# EAGLE schematic CircuitClockSchematic (EAGLE 9.3.0)
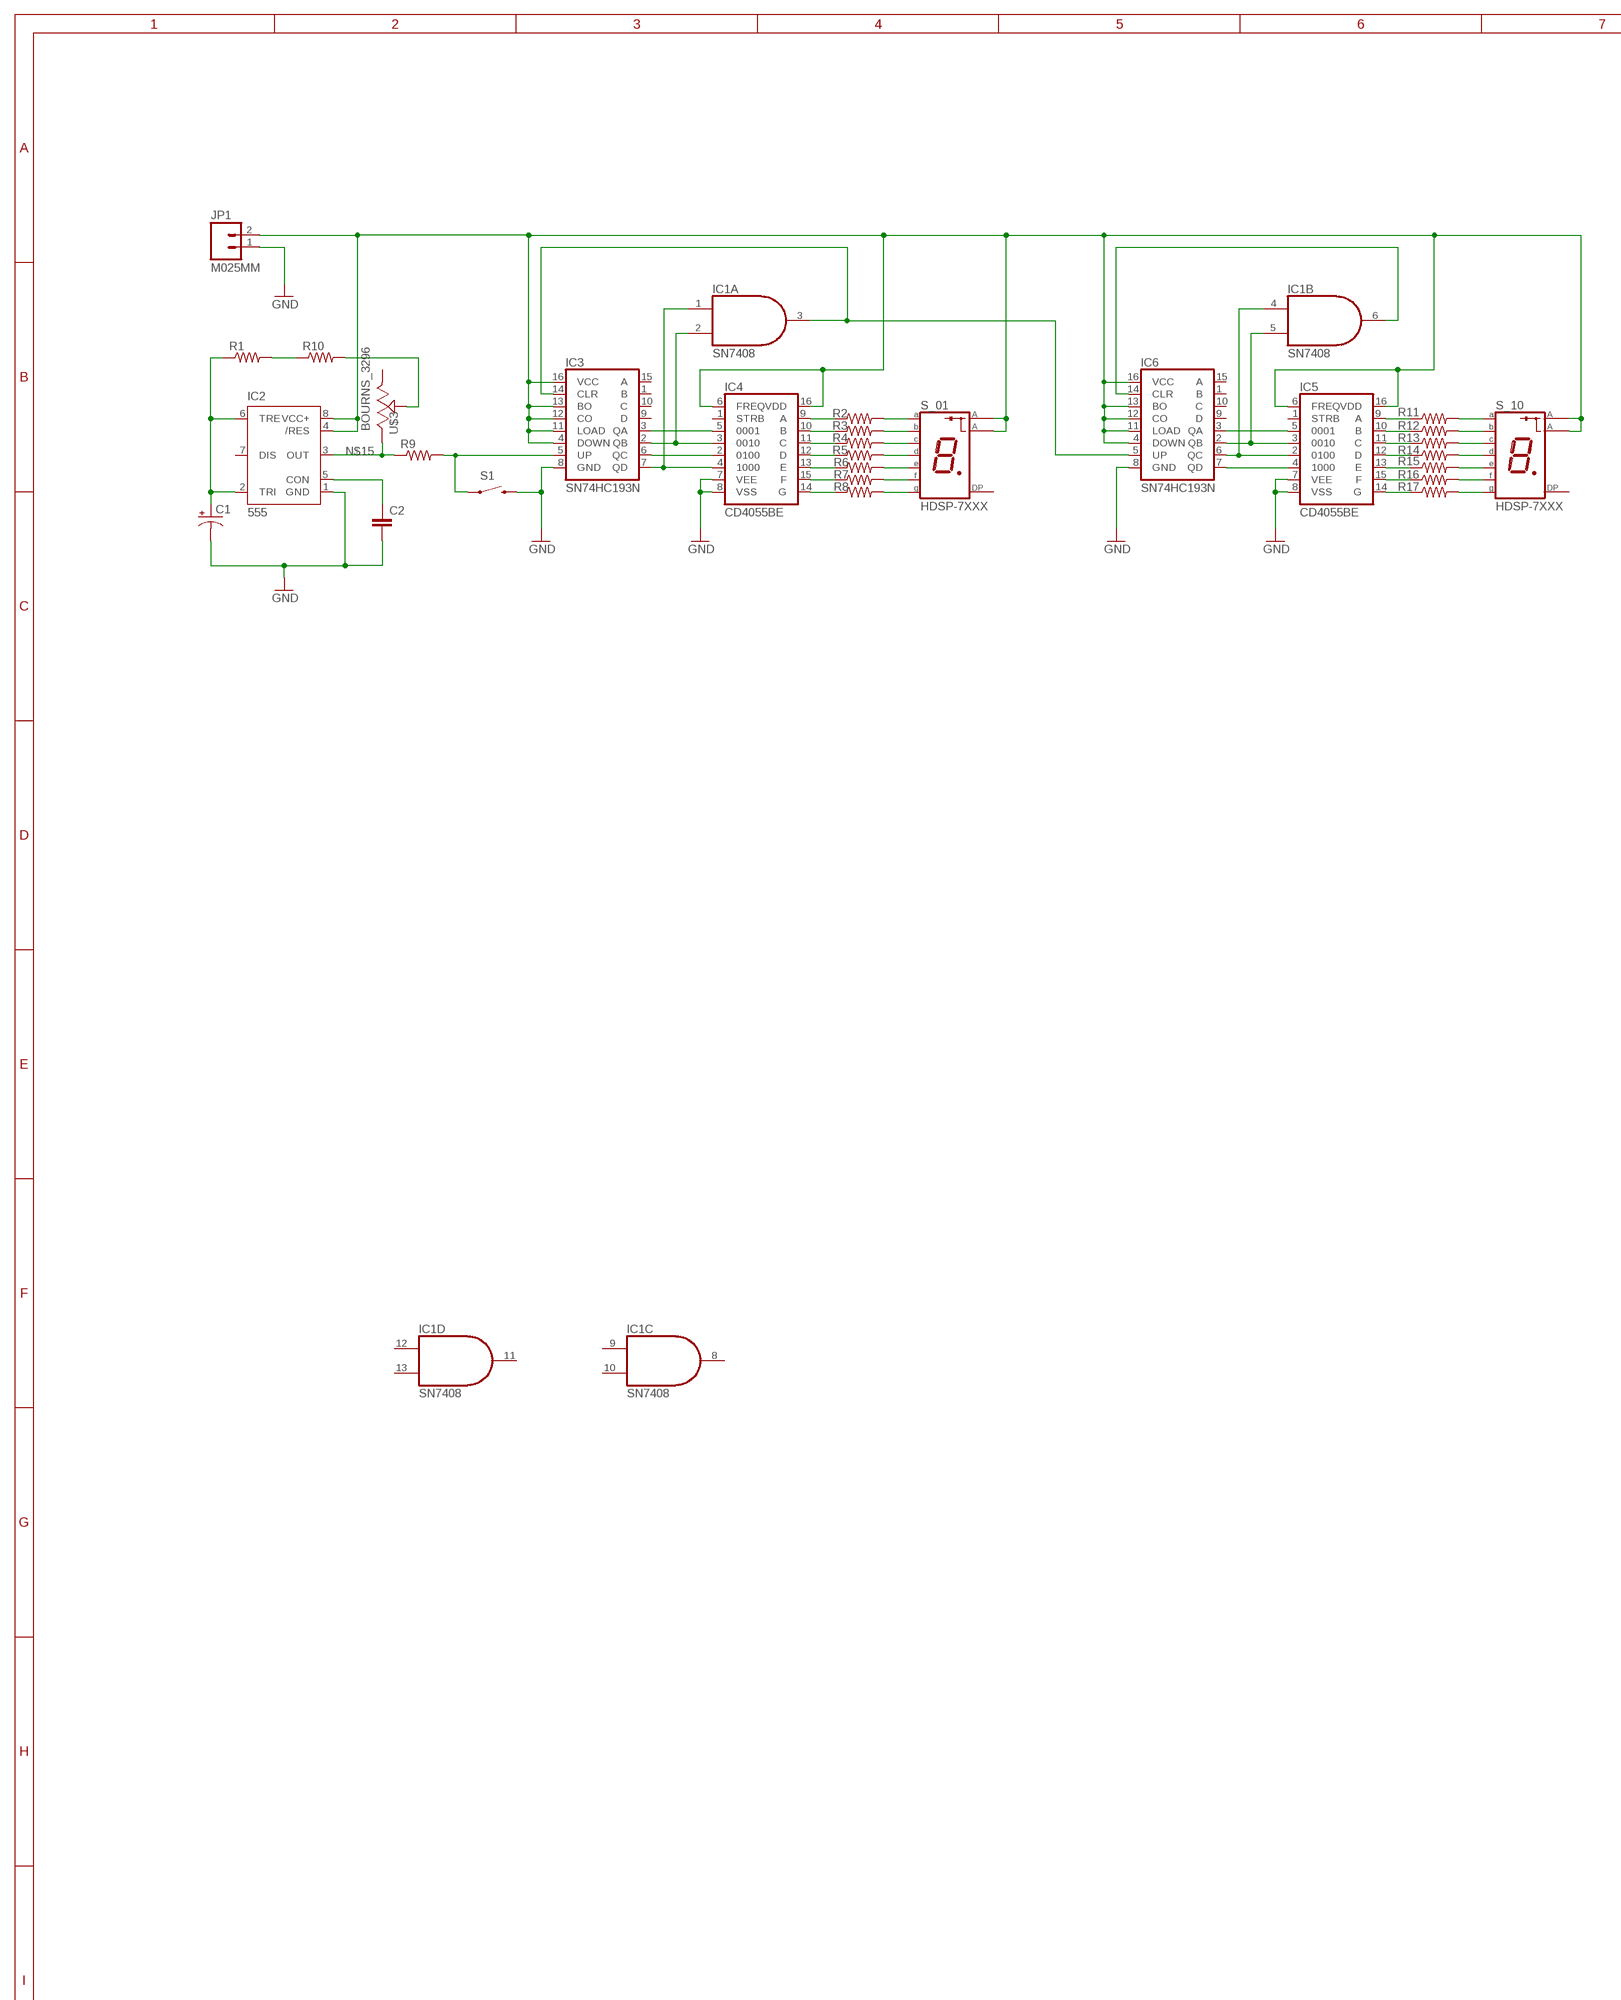
[diagram p0: schematic, sheet 1, part 1 of 2]
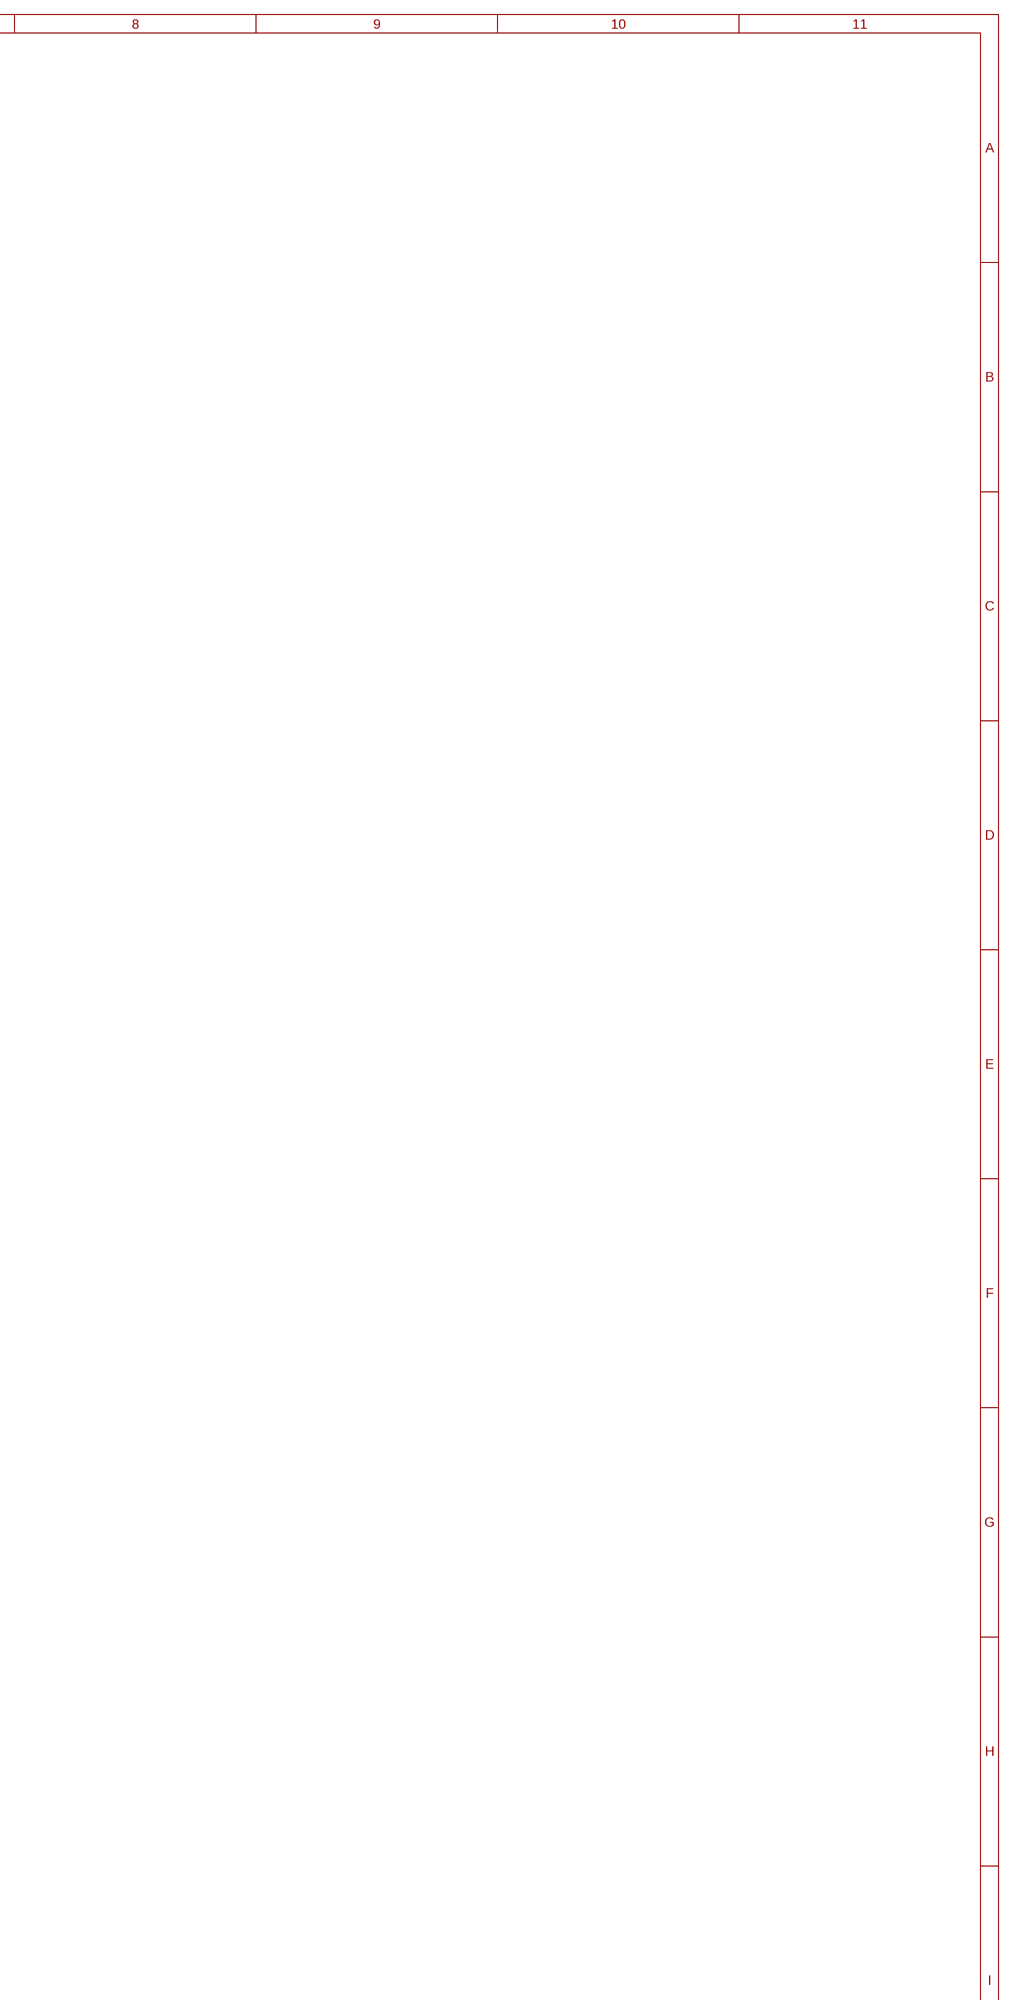
[diagram p1: schematic, sheet 1, part 2 of 2]

## Parts
C1  RADIAL_POL2.54MM_LEAD-6.3MM_DIA  [2.54MM_LEAD-6.3MM_DIA]
C2  CAPPTH  [CAP-PTH-SMALL]
IC1  SN7408  74S08N  [DIL14]
IC2  555  555KIT  [DIP08-KIT]
IC3  SN74HC193N  [DIL16]
IC4  CD4055BE  [DIL16]
IC5  CD4055BE  [DIL16]
IC6  SN74HC193N  [DIL16]
JP1  M025MM  [SCREWTERMINAL-5MM-2]
R1  RESISTORAXIAL-0.3  [AXIAL-0.3]
R2  RESISTORAXIAL-0.3  [AXIAL-0.3]
R3  RESISTORAXIAL-0.3  [AXIAL-0.3]
R4  RESISTORAXIAL-0.3  [AXIAL-0.3]
R5  RESISTORAXIAL-0.3  [AXIAL-0.3]
R6  RESISTORAXIAL-0.3  [AXIAL-0.3]
R7  RESISTORAXIAL-0.3  [AXIAL-0.3]
R8  RESISTORAXIAL-0.3  [AXIAL-0.3]
R9  RESISTORAXIAL-0.3  [AXIAL-0.3]
R10  RESISTORAXIAL-0.3  [AXIAL-0.3]
R11  RESISTORAXIAL-0.3  [AXIAL-0.3]
R12  RESISTORAXIAL-0.3  [AXIAL-0.3]
R13  RESISTORAXIAL-0.3  [AXIAL-0.3]
R14  RESISTORAXIAL-0.3  [AXIAL-0.3]
R15  RESISTORAXIAL-0.3  [AXIAL-0.3]
R16  RESISTORAXIAL-0.3  [AXIAL-0.3]
R17  RESISTORAXIAL-0.3  [AXIAL-0.3]
S1  SWITCH-MOMENTARY-2PTH  [TACTILE-PTH]
S_01  HDSP-7XXX  [HDSP-7XXX]
S_10  HDSP-7XXX  [HDSP-7XXX]
U$3  BOURNS_3296  [3296]

## Nets
CLK: IC3.5(UP) R9.P$2 S1.1
CLK_S10: IC1.3(A:O) IC3.14(CLR) IC6.5(UP)
GND: C1.- C2.2 IC2.1(GND) IC3.8(GND) IC4.7(VEE) IC4.8(VSS) IC5.7(VEE) IC5.8(VSS) IC6.8(GND) JP1.1 S1.3
N$1: IC1.4(B:I0) IC5.2 IC6.6(QC)
N$2: C1.+ IC2.2(TRI) IC2.6(TRE) R1.P$1
N$3: IC3.3(QA) IC4.5
N$4: C2.1 IC2.5(CON)
N$5: IC1.2(A:I1) IC3.2(QB) IC4.3
N$6: IC1.5(B:I1) IC5.3 IC6.2(QB)
N$8: IC4.9(A) R2.P$1
N$9: IC4.10(B) R3.P$1
N$10: IC4.11(C) R4.P$1
N$11: IC4.12(D) R5.P$1
N$12: IC4.13(E) R6.P$1
N$13: IC4.15(F) R7.P$1
N$14: IC4.14(G) R8.P$1
N$15: IC2.3(OUT) R9.P$1 U$3.1(A)
N$16: R2.P$2 S_01.P$10(A)
N$17: R3.P$2 S_01.P$9(B)
N$18: R4.P$2 S_01.P$8(C)
N$19: R5.P$2 S_01.P$5(D)
N$20: R6.P$2 S_01.P$4(E)
N$21: R7.P$2 S_01.P$2(F)
N$22: R8.P$2 S_01.P$3(G)
N$23: R1.P$2 R10.P$1
N$24: R10.P$2 U$3.2(S)
N$25: IC1.1(A:I0) IC3.7(QD) IC4.4
N$27: IC5.4 IC6.7(QD)
N$28: IC5.5 IC6.3(QA)
N$29: IC3.6(QC) IC4.2
N$30: IC5.9(A) R11.P$1
N$31: IC5.10(B) R12.P$1
N$32: IC5.11(C) R13.P$1
N$33: IC5.12(D) R14.P$1
N$34: IC5.13(E) R15.P$1
N$35: IC5.15(F) R16.P$1
N$36: IC5.14(G) R17.P$1
N$37: R11.P$2 S_10.P$10(A)
N$38: R12.P$2 S_10.P$9(B)
N$39: R13.P$2 S_10.P$8(C)
N$40: R14.P$2 S_10.P$5(D)
N$41: R15.P$2 S_10.P$4(E)
N$42: R16.P$2 S_10.P$2(F)
N$43: R17.P$2 S_10.P$3(G)
S10_CLR: IC1.6(B:O) IC6.14(CLR)
VCC: IC2.4(/RES) IC2.8(VCC+) IC3.4(DOWN) IC3.11(LOAD) IC3.12(CO) IC3.13(BO) IC3.16(VCC) IC4.6(FREQ) IC4.16(VDD) IC5.6(FREQ) IC5.16(VDD) IC6.4(DOWN) IC6.11(LOAD) IC6.12(CO) IC6.13(BO) IC6.16(VCC) JP1.2 S_01.P$1(A) S_01.P$6(A) S_10.P$1(A) S_10.P$6(A)
Unconnected: IC1.8(C:O) IC1.9(C:I0) IC1.10(C:I1) IC1.11(D:O) IC1.12(D:I0) IC1.13(D:I1) IC2.7(DIS) IC3.1(B) IC3.9(D) IC3.10(C) IC3.15(A) IC4.1(STRB) IC5.1(STRB) IC6.1(B) IC6.9(D) IC6.10(C) IC6.15(A) S_01.P$7(DP) S_10.P$7(DP) U$3.3(E)

## Power pins joined to a net without a drawn wire
GND: IC1.7(P:GND)
VCC: IC1.14(P:VCC)

## Library data of the parts
C1 = Capacitors:RADIAL_POL
C2 = SparkFun-Capacitors:CAP: Capacitor Standard 0603 ceramic capacitor, and 0.1" leaded capacitor.
IC1 = 74xx-us:74*08: Quad 2-input AND gate
IC2 = SparkFun-IC-Special-Function:555: General purpose bipolar Timer Datasheet <http://www.sparkfun.com/datasheets/Components/General/ne555.pdf> SparkFun Products SparkFun SparkPunk Sequencer Kit <https://www.sparkfun.com/products/12707> (KIT-12707) Storefront Component: 555 Timer <https://www.sparkfun.com/products/9273> (COM-09273) Two parts valid for production: VFP: IC-11930 (M7555 PTH) VFP: IC-09173 (555 PTH) - Preferred; PROD_ID: IC-09173; PROD_ID_ALT: IC-11930
IC3 IC6 = ICs:SN74HC193N
IC4 IC5 = ICs:CD4055BE
JP1 = SparkFun-Connectors:M02: Standard 2-pin 0.1" header. Use with - straight break away headers ( PRT-00116) - right angle break away headers (PRT-00553) - swiss pins (PRT-00743) - machine pins (PRT-00117) - female headers (PRT-00115) Molex polarized connector foot print use with: PRT-08233 with associated crimp pins and housings. 2.54_SCREWTERM for use with PRT-10571. 3.5mm Screw Terminal footprints for PRT-08084 5mm Screw Terminal footprints for use with PRT-08432; STOREFRONT_ID: PRT-08432
R1-R17 = SparkFun-Passives:RESISTOR: Resistor Basic schematic elements and footprints for 0603, 1206, and PTH resistors.
S1 = SparkFun-Electromechanical:SWITCH-MOMENTARY-2: Various NO switches- pushbuttons, reed, etc
S_01 S_10 = led-7-segment:HDSP-7XXX
U$3 = Offboard Potentiometer:BOURNS_3296